# Altium schematic sheet MotherBoard_Driver_Communication.SchDoc
size A; SheetNumber: 5; SheetTotal: 9
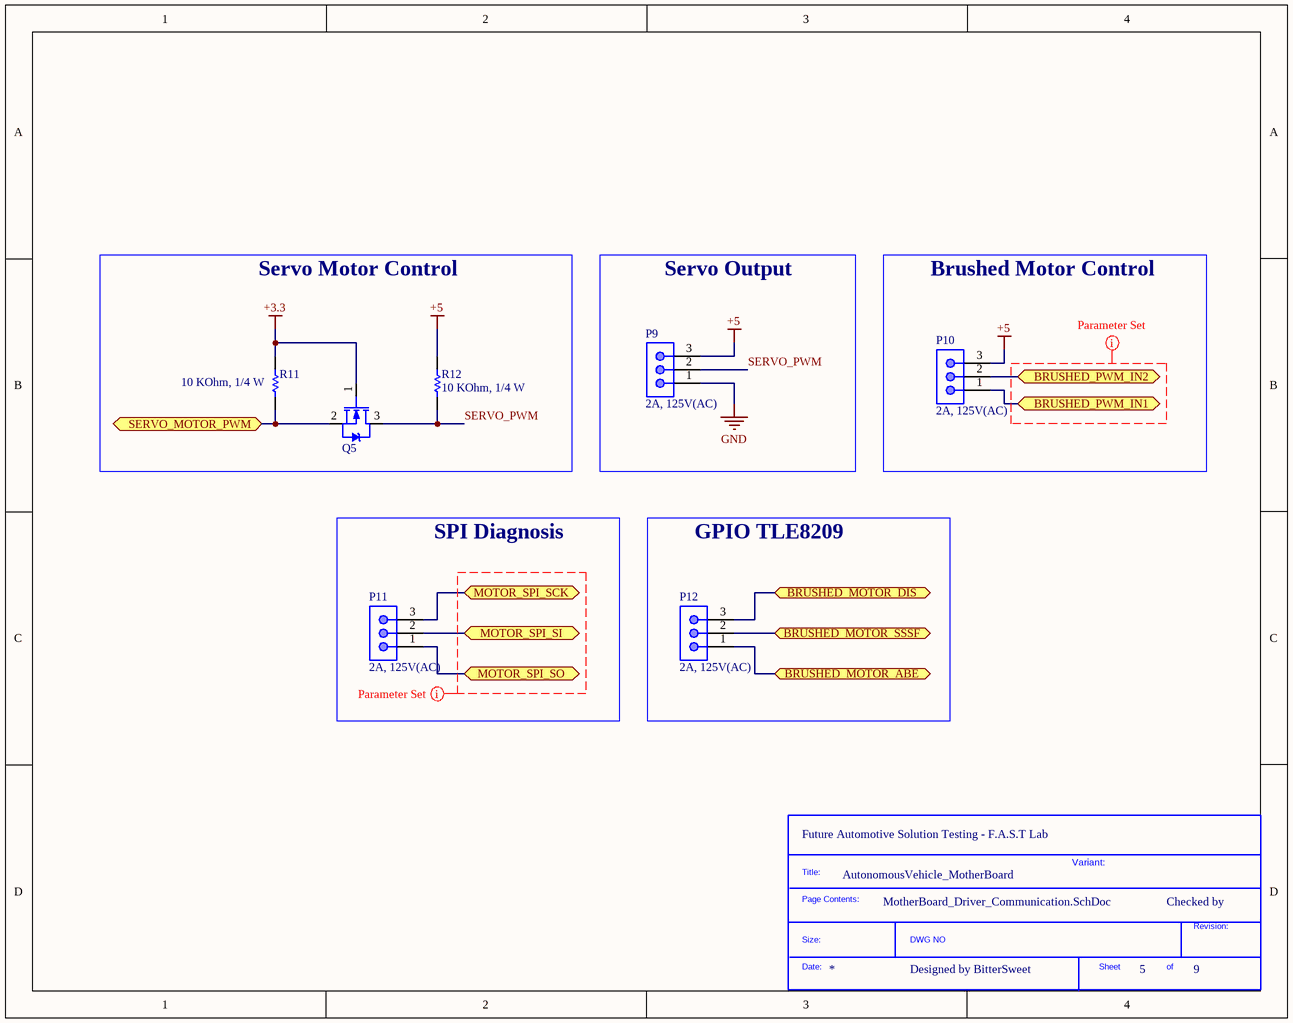
[diagram p0: MotherBoard_Driver_Communication.SchDoc]

## Parts
*?  SDTitleBlock  (value not drawn)  (graphical)
P9  2A, 125V(AC)  [620103131822]
P10  2A, 125V(AC)  [620103131822]
P11  2A, 125V(AC)  [620103131822]
P12  2A, 125V(AC)  [620103131822]
Q5  Mosfet_N_channel  [MOSFET_N_SOT23-3]  (value not drawn)
R11  10 KOhm, 1/4 W  [resistor_0603]
R12  10 KOhm, 1/4 W  [resistor_0603]

## Blocks framed on the sheet
Servo Motor Control: Q5 R11 R12
Servo Output: P9
Brushed Motor Control: P10
SPI Diagnosis: P11
GPIO TLE8209: P12

## Ports
BRUSHED_MOTOR_ABE (bidir), BRUSHED_MOTOR_DIS (bidir), BRUSHED_MOTOR_SSSF (bidir), BRUSHED_PWM_IN1 (bidir), BRUSHED_PWM_IN2 (bidir), MOTOR_SPI_SCK (bidir), MOTOR_SPI_SI (bidir), MOTOR_SPI_SO (bidir), SERVO_MOTOR_PWM (bidir)

## Nets
+3.3: Q5.1(G) R11.2
+5: P9.3 P10.3 R12.2
GND: P9.1
BRUSHED_MOTOR_ABE: P12.1 ; port BRUSHED_MOTOR_ABE
BRUSHED_MOTOR_DIS: P12.3 ; port BRUSHED_MOTOR_DIS
BRUSHED_MOTOR_SSSF: P12.2 ; port BRUSHED_MOTOR_SSSF
BRUSHED_PWM_IN1: P10.1 ; port BRUSHED_PWM_IN1
BRUSHED_PWM_IN2: P10.2 ; port BRUSHED_PWM_IN2
MOTOR_SPI_SCK: P11.3 ; port MOTOR_SPI_SCK
MOTOR_SPI_SI: P11.2 ; port MOTOR_SPI_SI
MOTOR_SPI_SO: P11.1 ; port MOTOR_SPI_SO
SERVO_MOTOR_PWM: Q5.2(S) R11.1 ; port SERVO_MOTOR_PWM
SERVO_PWM: P9.2 Q5.3(D) R12.1

## Layout directives
net class SPI_DIAGNOSIS: (no net found under the mark)
net class BDC_PWM: (no net found under the mark)

## Notes on the sheet
- (near *?) Future Automotive Solution Testing - F.A.S.T Lab
- AutonomousVehicle_MotherBoard
- Variant:
- Checked by
- Designed by BitterSweet
- (in symbol SDTitleBlock) Title:; Page Contents:; Revision:; Size:; DWG NO; Date:; Sheet; of

## Library data of the parts
P9-P12 = 620103131822: WR-WTB SMT Male Horizontal Shrouded Header, pitch 2mm, 3p; Pin Number: 3; Contact Resistance: 20mOhm; Withstanding Voltage: 800VAC; Working Voltage: 100VAC; ComponentLink1Description: Manufacturer; ComponentLink1URL: http://www.we-online.de; ComponentLink2Description: Datasheet; ComponentLink2URL: https://www.we-online.com/catalog/datasheet/620103131822.pdf; Pitch: 2mm; Published Date: January 2020; Publisher: Wurth Elektronik; Mounting Technology: SMT; Packaging: Tape and Reel; Operating Temperature: -25 to +85degC; Part Number: 620103131822; Gender: Male; Type: Horizontal; Rated Current: 2A; ComponentLink3Description: Global Supply; ComponentLink3URL: https://www.we-online.com/en/components/products/WTB_2_00_SMT_MALE_HORIZONTAL_SHROUDED_HEADER_6201XX131822?sq=620103131822#620103131822; ComponentLink4Description: Global Supply; ComponentLink4URL: https://www.mouser.vn/ProductDetail/Wurth-Elektronik/620103131822?qs=ZtY9WdtwX54jBicvPVEzcw%3D%3D; Supplier 1 Name: Mouser; Supplier 1 SN: 710-620103131822; Supplier 1 URL: https://www.mouser.vn/ProductDetail/Wurth-Elektronik/620103131822?qs=ZtY9WdtwX54jBicvPVEzcw%3D%3D; Supplier 2 Name: Digi-Key; Supplier 2 SN: N/A; Supplier 2 URL: N/A; Supplier 3 Name: thegioiic; Supplier 3 SN: N/A; Supplier 3 URL: N/A; Value: 2A, 125V(AC)
R11 R12 = 0006031031: RES, size 0603, 10 KOhm, 1/4 W; Manufacture  Name: OEM; Resistance: 10 KOhm; Rated Power: 1/4 W; Resistance Tolerance: +/-1%; Size: 0603; Mounting Technology: SMT; Supplier 1 Name: Mouser; Supplier 1 SN: 755-ESR03EZPF1002; Supplier 2 Name: Digi-Key; Supplier 2 SN: RHM10KADTR-ND RHM10KADCT-ND RHM10KADDKR-ND; Supplier 1 URL: https://www.mouser.vn/ProductDetail/ROHM-Semiconductor/ESR03EZPF1002?qs=sGAEpiMZZMvdGkrng054t67Efho1F8r6CDeAsqwFse8%3D; Supplier 3 Name: thegioiic; Supplier 3 SN: N/A; Supplier 3 URL: N/A; Manufacture  SN: OEM; Value: 10 KOhm, 1/4 W; ComponentLink1Description: Datasheet link; ComponentLink1URL: https://fscdn.rohm.com/en/products/databook/datasheet/passive/resistor/chip_resistor/esr-e.pdf; ComponentLink2Description: Supplier 1 URL; ComponentLink2URL: https://www.thegioiic.com/dien-tro-10-kohm-0603-1-; ComponentLink3Description: Supplier 2 URL; ComponentLink3URL: https://www.digikey.com/en/products/detail/rohm-semiconductor/ESR03EZPF1002/1983429; ComponentLink4Description: Supplier 3 URL; ComponentLink4URL: N/A; Supplier 2 URL: https://www.digikey.com/en/products/detail/rohm-semiconductor/ESR03EZPF1002/1983429; JLCPCB Part: C2087321; Parameter 1: *; ComponentLink5Description: JLCPCB Link; ComponentLink5URL: https://jlcpcb.com/partdetail/Yageo-RT0603BRD1010KL/C2087321
Q5 = Mosfet_N_channel: ComponentLink1Description: JLCPCB Link; ComponentLink1URL: https://jlcpcb.com/partdetail/HXYMOSFET-Si2300DS_T1_GE3HXY/C22367238; JLCPCB Part: C22367238